# EAGLE schematic smoggie (EAGLE 8.3.1)
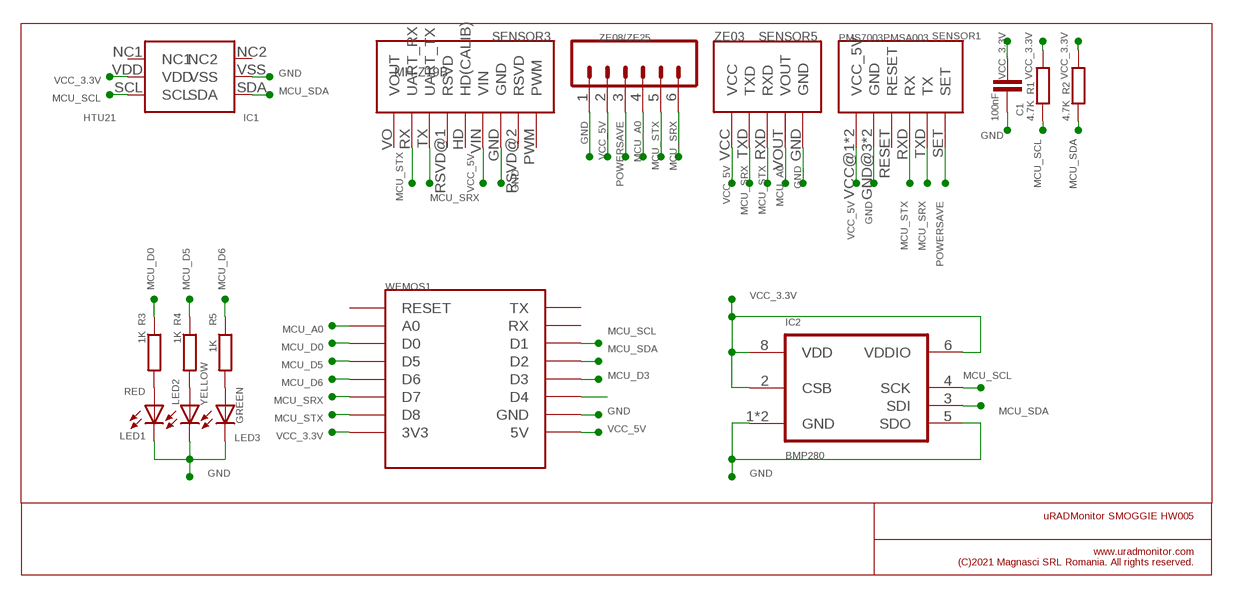
[diagram p0: schematic, sheet 1]

## Parts
C1  100nF  C-EUC0603  [C0603]
IC1  HTU21  SHT21SMDSMD  [SHT21]
IC2  BMP280  [BMP280]
LED1  RED  LEDSML0603  [SML0603]
LED2  YELLOW  LEDSML0603  [SML0603]
LED3  GREEN  LEDSML0603  [SML0603]
R1  4.7K  R-EU_R0603  [R0603]
R2  4.7K  R-EU_R0603  [R0603]
R3  1K  R-EU_R0603  [R0603]
R4  1K  R-EU_R0603  [R0603]
R5  1K  R-EU_R0603  [R0603]
SENSOR1  PMS7003PMSA003  [PMSA003]
SENSOR3  MH-Z19B  [MH-Z19B]
SENSOR5  ZE03  [ZE03]
WEMOS1  11  WEMOS-D1-MINI  [WEMOS-D1-MINI]
ZE08/ZE25  M06SIP  [1X06]

## Nets
GND: C1.1 IC1.VSS IC2.1(GND) IC2.5(SDO) IC2.7(GND) LED1.C LED2.C LED3.C SENSOR1.GND@3(GND) SENSOR1.GND@4(GND) SENSOR3.GND SENSOR5.GND WEMOS1.GND ZE08/ZE25.1
MCU_A0: SENSOR5.VOUT WEMOS1.A0 ZE08/ZE25.4
MCU_D0: R3.1 WEMOS1.D0
MCU_D3: WEMOS1.D3
MCU_D5: R4.1 WEMOS1.D5
MCU_D6: R5.1 WEMOS1.D6
MCU_SCL: IC1.SCL IC2.4(SCK) R1.2 WEMOS1.D1
MCU_SDA: IC1.SDA IC2.3(SDI) R2.2 WEMOS1.D2
MCU_SRX: SENSOR1.TXD(TX) SENSOR3.TX(UART_TX) SENSOR5.TXD WEMOS1.D7 ZE08/ZE25.6
MCU_STX: SENSOR1.RXD(RX) SENSOR3.RX(UART_RX) SENSOR5.RXD WEMOS1.D8 ZE08/ZE25.5
N$1: LED2.A R4.2
N$3: LED3.A R5.2
N$6: LED1.A R3.2
N$7: WEMOS1.D4
POWERSAVE: SENSOR1.SET ZE08/ZE25.3
VCC_3.3V: C1.2 IC1.VDD IC2.2(CSB) IC2.6(VDDIO) IC2.8(VDD) R1.1 R2.1 WEMOS1.3V3
VCC_5V: SENSOR1.VCC@1(VCC_5V) SENSOR1.VCC@2(VCC_5V) SENSOR3.VIN SENSOR5.VCC WEMOS1.5V ZE08/ZE25.2
Unconnected: IC1.NC1 IC1.NC2 SENSOR1.RESET SENSOR3.HD(HD(CALIB)) SENSOR3.PWM SENSOR3.RSVD@1(RSVD) SENSOR3.RSVD@2(RSVD) SENSOR3.VO(VOUT) WEMOS1.RESET WEMOS1.RX WEMOS1.TX

## Notes on the sheet
- uRADMonitor SMOGGIE HW005
- www.uradmonitor.com
  (C)2021 Magnasci SRL Romania. All rights reserved.

## Library data of the parts
C1 = rcl:C-EU: CAPACITOR, European symbol
IC1 = sensirion-sht-sensors:SHT21: SHT 21 (Senzor) EN: Type: Humidity and Temperature Senzor ± 2% Case: DFN6 Interface: I2C Manufacturer: SENSIRION CZ: Typ: Senzor Teploty a Vlhkosti ± 2% Pouzdro: DFN6 Rozhraní: I2C Výrobce: SENSIRION Datasheet: https://html.alldatasheet.com/html-pdf/347386/SENSITRON/SHT21/484/1/SHT21.html Created by: GreyhoundPCBDesign
IC2 = bosch-bmp280:BMP280: The BMP280 is an absolute barometric pressure sensor especially designed for mobile applications. The sensor module is housed in an extremely compact 8-pin metal-lid LGA package with a footprint of only 2.0 × 2.5 mm2 and 0.95 mm package height. Its small dimensions and its low power consumption of 2.7 μA @1Hz allow the implementation in battery driven devices such as mobile phones, GPS modules or watches. The library has been designed by Richard Magdycz <https://www.facebook.com/groups/eaglecadsoftUK>
LED1-LED3 = led:LED: LED OSRAM: - CHIPLED LG R971, LG N971, LY N971, LG Q971, LY Q971, LO R971, LY R971 LH N974, LH R974 LS Q976, LO Q976, LY Q976 LO Q996 - Hyper CHIPLED LW Q18S LB Q993, LB Q99A, LB R99A - SideLED LS A670, LO A670, LY A670, LG A670, LP A670 LB A673, LV A673, LT A673, LW A673 LH A674 LY A675 LS A676, LA A676, LO A676, LY A676, LW A676 LS A679, LY A679, LG A679 - Hyper Micro SIDELED® LS Y876, LA Y876, LO Y876, LY Y876 LT Y87S - SmartLED LW L88C, LW L88S LB L89C, LB L89S, LG L890 LS L89K, LO L89K, LY L89K LS L896, LA L896, LO L896, LY L896 - TOPLED LS T670, LO T670, LY T670, LG T670, LP T670 LSG T670, LSP T670, LSY T670, LOP T670, LYG T670 LG T671, LOG T671, LSG T671 LB T673, LV T673, LT T673, LW T673 LH T674 LS T676, LA T676, LO T676, LY T676, LB T676, LH T676, LSB T676, LW T676 LB T67C, LV T67C, LT T67C, LS T67K, LO T67K, LY T67K, LW E67C LS E67B, LA E67B, LO E67B, LY E67B, LB E67C, LV E67C, LT E67C LW T67C LS T679, LY T679, LG T679 LS T770, LO T770, LY T770, LG T770, LP T770 LB T773, LV T773, LT T773, LW T773 LH T774 LS E675, LA E675, LY E675, LS T675 LS T776, LA T776, LO T776, LY T776, LB T776 LHGB T686 LT T68C, LB T68C - Hyper Mini TOPLED® LB M676 - Mini TOPLED Santana® LG M470 LS M47K, LO M47K, LY M47K Source: http://www.osram.convergy.de LUXEON: - LUMILED® LXK2-PW12-R00, LXK2-PW12-S00, LXK2-PW14-U00, LXK2-PW14-V00 LXK2-PM12-R00, LXK2-PM12-S00, LXK2-PM14-U00 LXK2-PE12-Q00, LXK2-PE12-R00, LXK2-PE12-S00, LXK2-PE14-T00, LXK2-PE14-U00 LXK2-PB12-K00, LXK2-PB12-L00, LXK2-PB12-M00, LXK2-PB14-N00, LXK2-PB14-P00, LXK2-PB14-Q00 LXK2-PR12-L00, LXK2-PR12-M00, LXK2-PR14-Q00, LXK2-PR14-R00 LXK2-PD12-Q00, LXK2-PD12-R00, LXK2-PD12-S00 LXK2-PH12-R00, LXK2-PH12-S00 LXK2-PL12-P00, LXK2-PL12-Q00, LXK2-PL12-R00 Source: www.luxeon.com KINGBRIGHT: KA-3528ASYC Source: www.kingbright.com
R1-R5 = resistor:R-EU_: RESISTOR, European symbol
SENSOR1 = uradmonitor:PMS7003: Plantower PMS-7003 Air Quality Sensor for PM0.3, PM0.5, PM1.0, PM2.5, PM5.0, PM10.0 Key Features ◆ laser scattering principle to achieve accurate measurement ◆ zero error alarm rate ◆ real-time response and support continuous acquisition ◆ minimum resolution particle size 0.3μ m ◆ new patent structure, six full range of shielding, anti-jamming performance stronger ◆ The direction of the inlet and outlet can be selected, the scope of application is wide and the user does not need to design the air duct again ◆ ultra-thin design, only 12 mm, suitable for portable devices Overview PMS7003 is a digital versatile particle concentration sensor based on the principle of laser scattering, continuous mining And calculate the number of suspended particles in different sizes of air in the unit volume, that is, the concentration distribution of particles, And converted into mass concentration, and in the form of general digital interface output. The sensor can be embedded in a variety of air Suspended particle concentration in the instrument or environmental improvement equipment, to provide timely and accurate concentration according to.
SENSOR3 = uradmonitor:MH-Z19B: Winsensor CO2 NDIR sensor
SENSOR5 = uradmonitor:ZE03: Winsensor ZE03 sensor for CO, NO2, SO2, O3, Cl2, H2S, NH3, etc
WEMOS1 = esp8266modules_2:WEMOS-D1-MINI: WeMos.cc D1 mini ESP8266 module
ZE08/ZE25 = sparkfun-connectors:M06: Header 6 Standard 6-pin 0.1" header. Use with straight break away headers (SKU : PRT-00116), right angle break away headers (PRT-00553), swiss pins (PRT-00743), machine pins (PRT-00117), and female headers (PRT-00115). Molex polarized connector foot print use with SKU : PRT-08094 with associated crimp pins and housings. NOTES ON THE VARIANTS LOCK and LOCK_LONGPADS... This footprint was designed to help hold the alignment of a through-hole component (i.e. 6-pin header) while soldering it into place. You may notice that each hole has been shifted either up or down by 0.005 of an inch from it's more standard position (which is a perfectly straight line). This slight alteration caused the pins (the squares in the middle) to touch the edges of the holes. Because they are alternating, it causes a "brace" to hold the component in place. 0.005 has proven to be the perfect amount of "off-center" position when using our standard breakaway headers. Although looks a little odd when you look at the bare footprint, once you have a header in there, the alteration is very hard to notice. Also,if you push a header all the way into place, it is covered up entirely on the bottom side. This idea of altering the position of holes to aid alignment will be further integrated into the Sparkfun Library for other footprints. It can help hold any component with 3 or more connection pins.